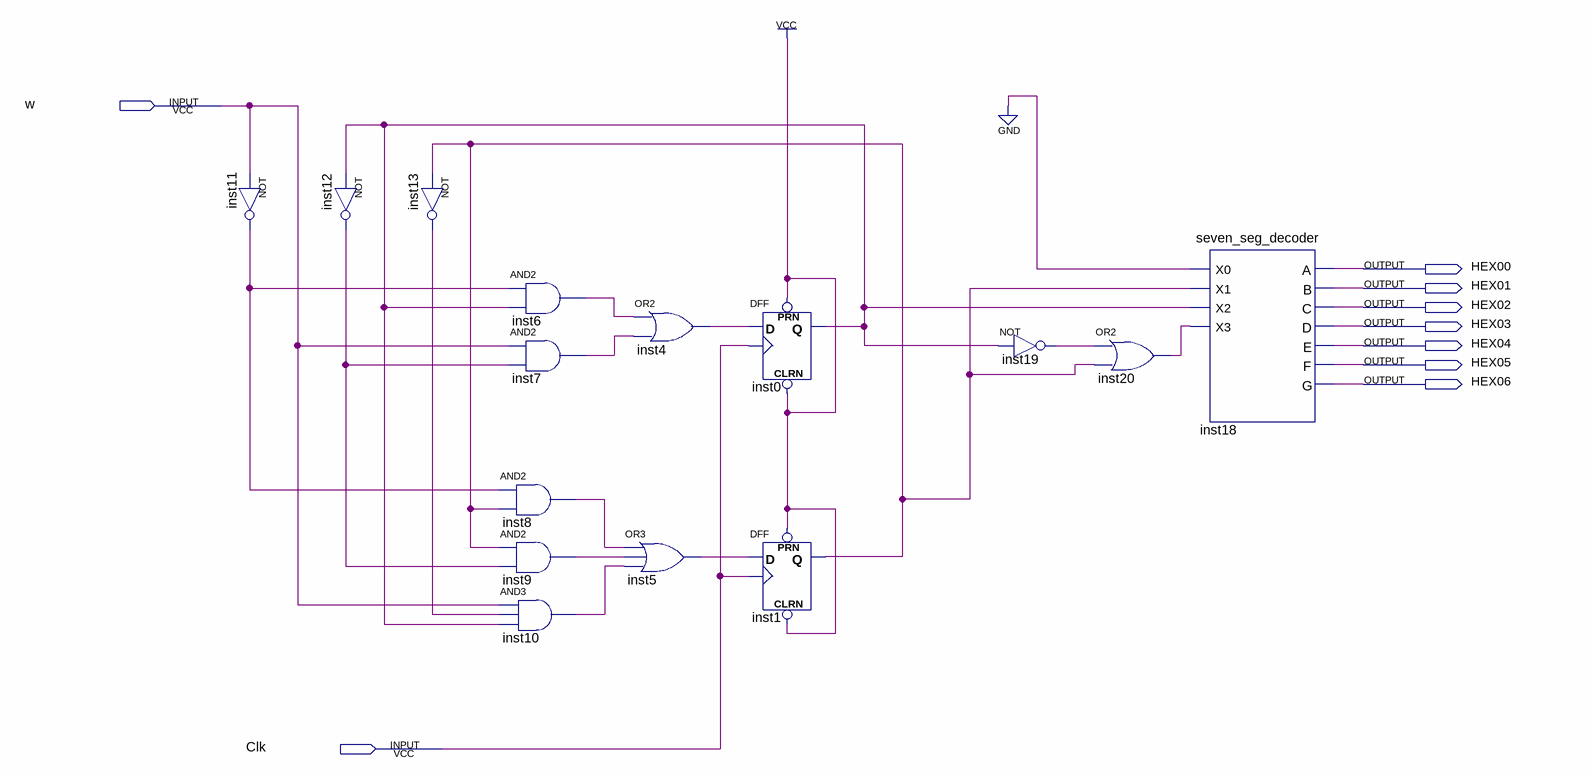
[diagram p0: schematic sheet]
// Quartus schematic lab11step2.bdf as structural Verilog: 15 symbols, 9 pins
module lab11step2 (
  input  w,
  input  Clk,
  output HEX00,
  output HEX01,
  output HEX02,
  output HEX03,
  output HEX04,
  output HEX05,
  output HEX06
);

  wire inst0_q, inst1_q, inst4_out, inst5_out, inst6_out, inst7_out, inst8_out, inst9_out, inst10_out,
       inst11_out, inst12_out, inst13_out, inst19_out, inst20_out;

  not inst11 (inst11_out, w);
  not inst12 (inst12_out, inst0_q);
  not inst13 (inst13_out, inst1_q);
  and inst6 (inst6_out, inst11_out, inst0_q);
  and inst7 (inst7_out, w, inst12_out);
  and inst8 (inst8_out, inst11_out, inst1_q);
  and inst9 (inst9_out, inst1_q, inst12_out);
  and inst10 (inst10_out, w, inst13_out, inst0_q);
  or inst4 (inst4_out, inst6_out, inst7_out);
  or inst5 (inst5_out, inst8_out, inst9_out, inst10_out);
  DFF inst0 (.CLRN(1'b1), .CLK(Clk), .D(inst4_out), .PRN(1'b1), .Q(inst0_q));
  DFF inst1 (.CLRN(1'b1), .CLK(Clk), .D(inst5_out), .PRN(1'b1), .Q(inst1_q));
  not inst19 (inst19_out, inst0_q);
  or inst20 (inst20_out, inst19_out, inst1_q);
  seven_seg_decoder inst18 (
    .X0(1'b0), .X1(inst1_q), .X2(inst0_q), .X3(inst20_out), .A(HEX00), .B(HEX01), .C(HEX02), .D(HEX03),
    .E(HEX04), .F(HEX05), .G(HEX06));
endmodule
